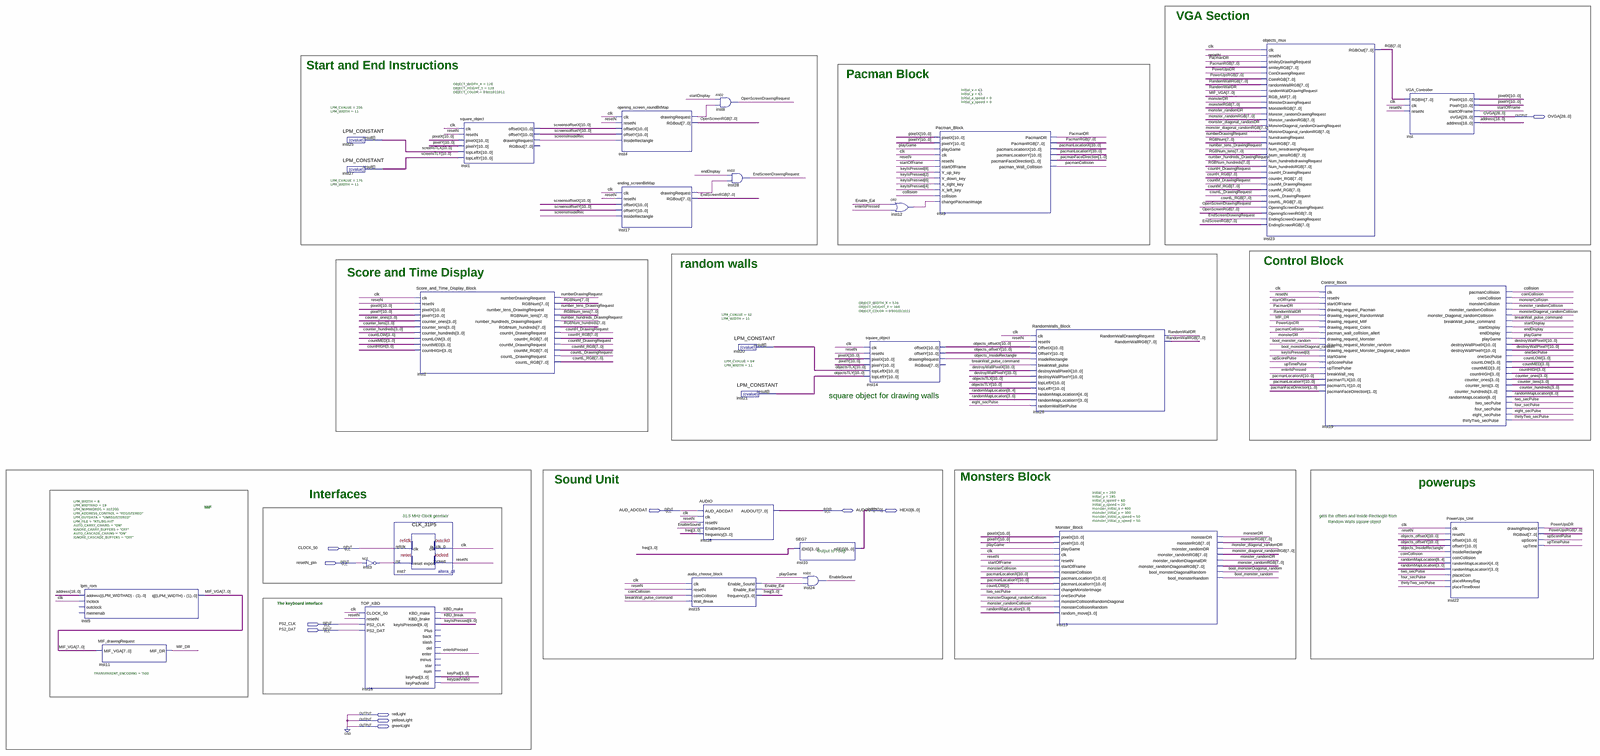
[diagram p0: schematic sheet, whole]
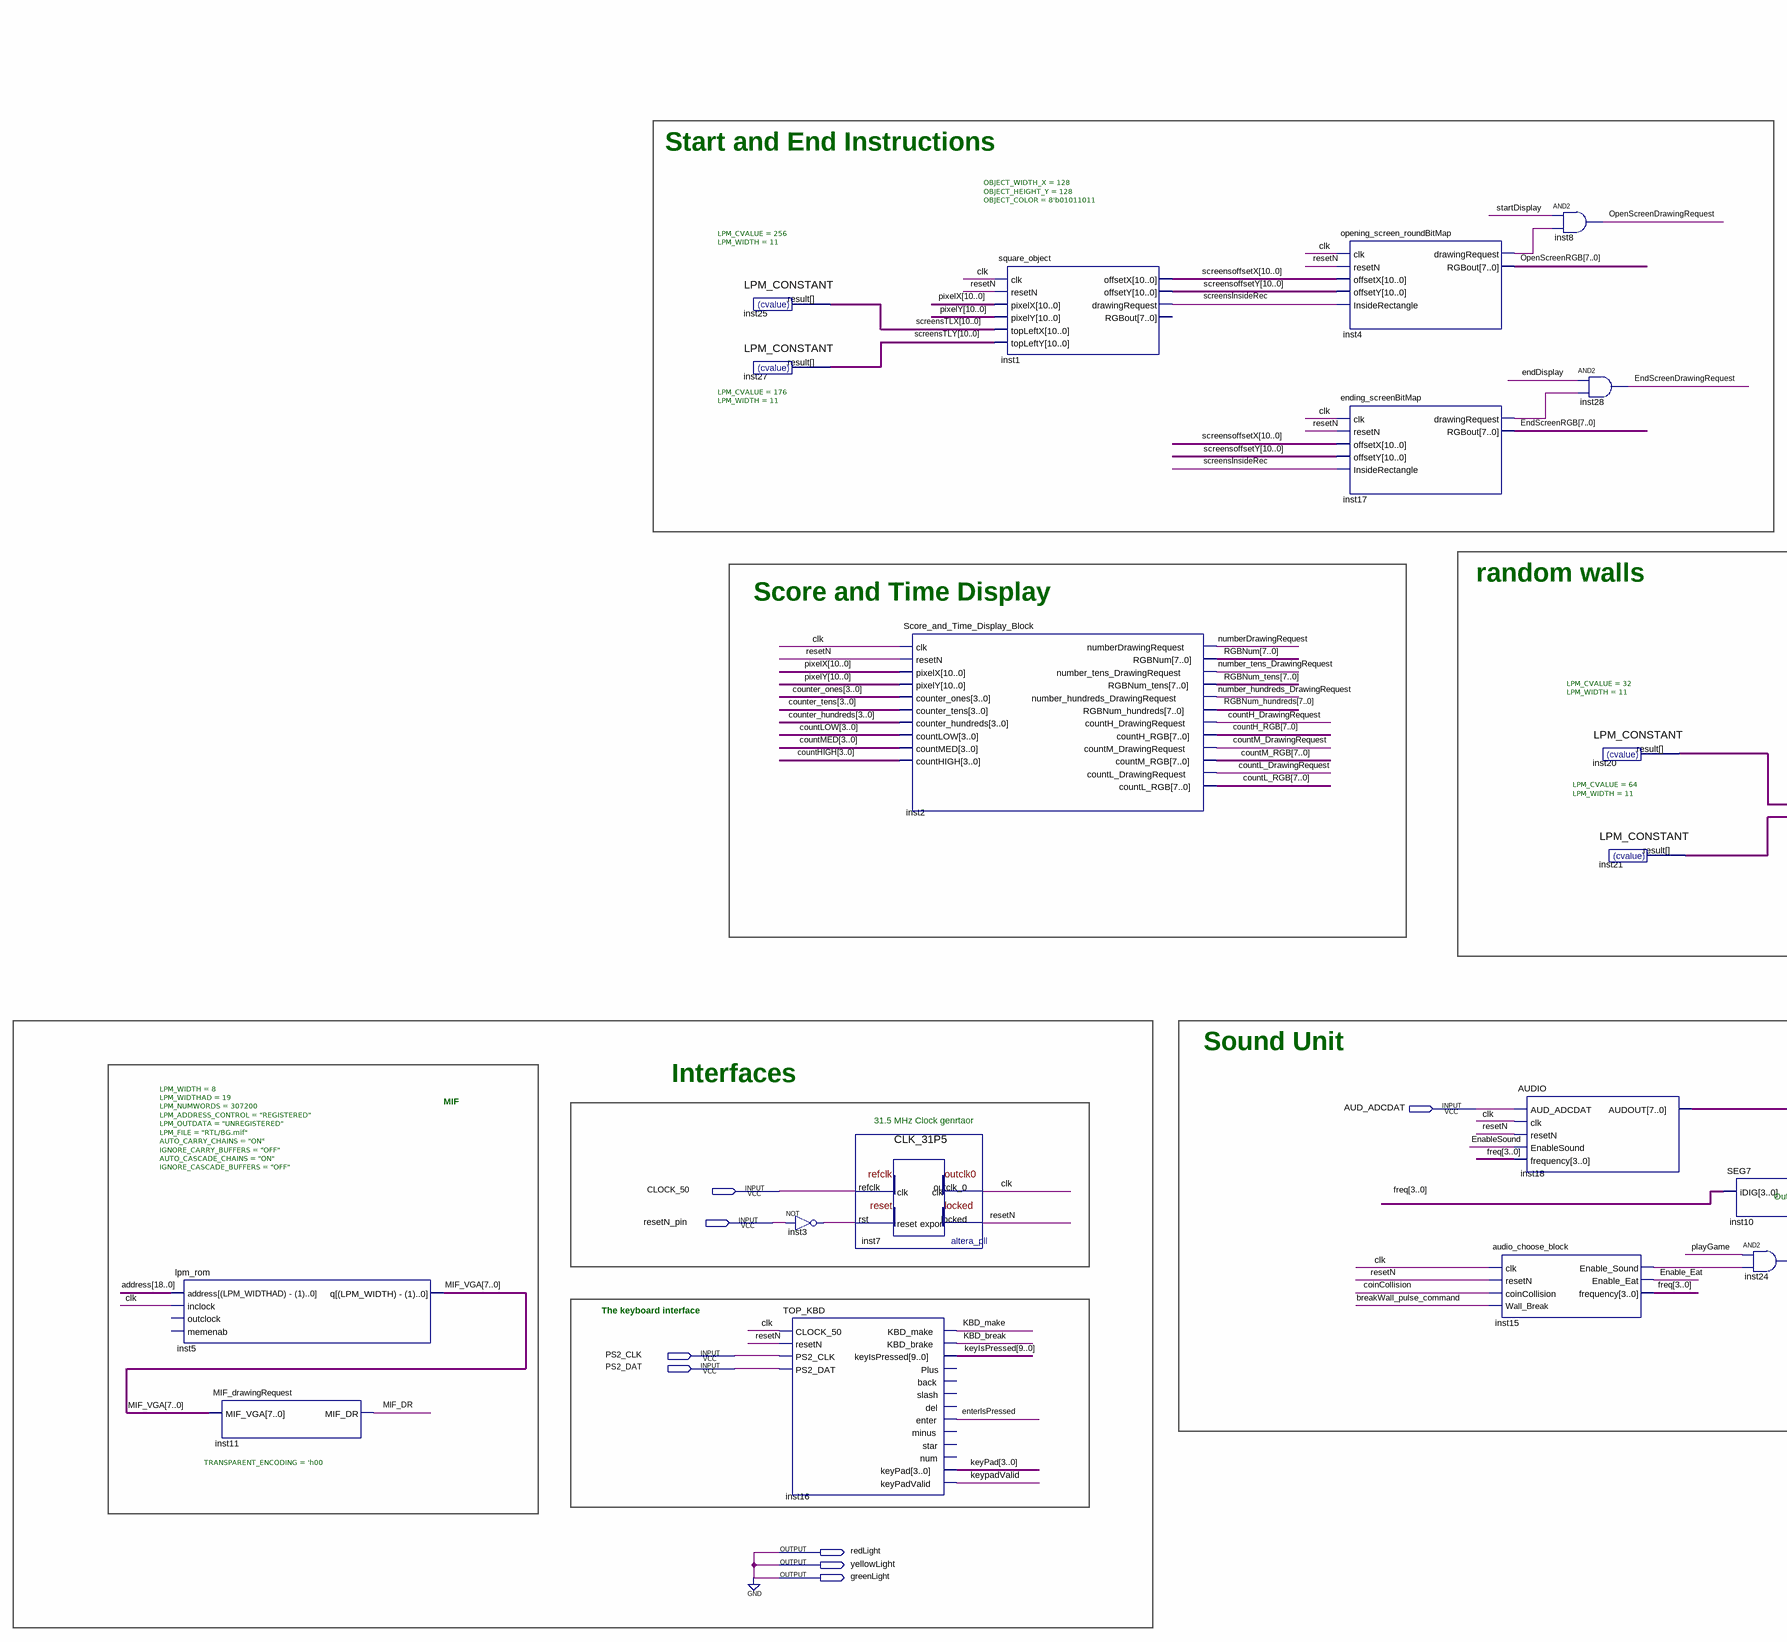
[diagram p1: schematic sheet, left part]
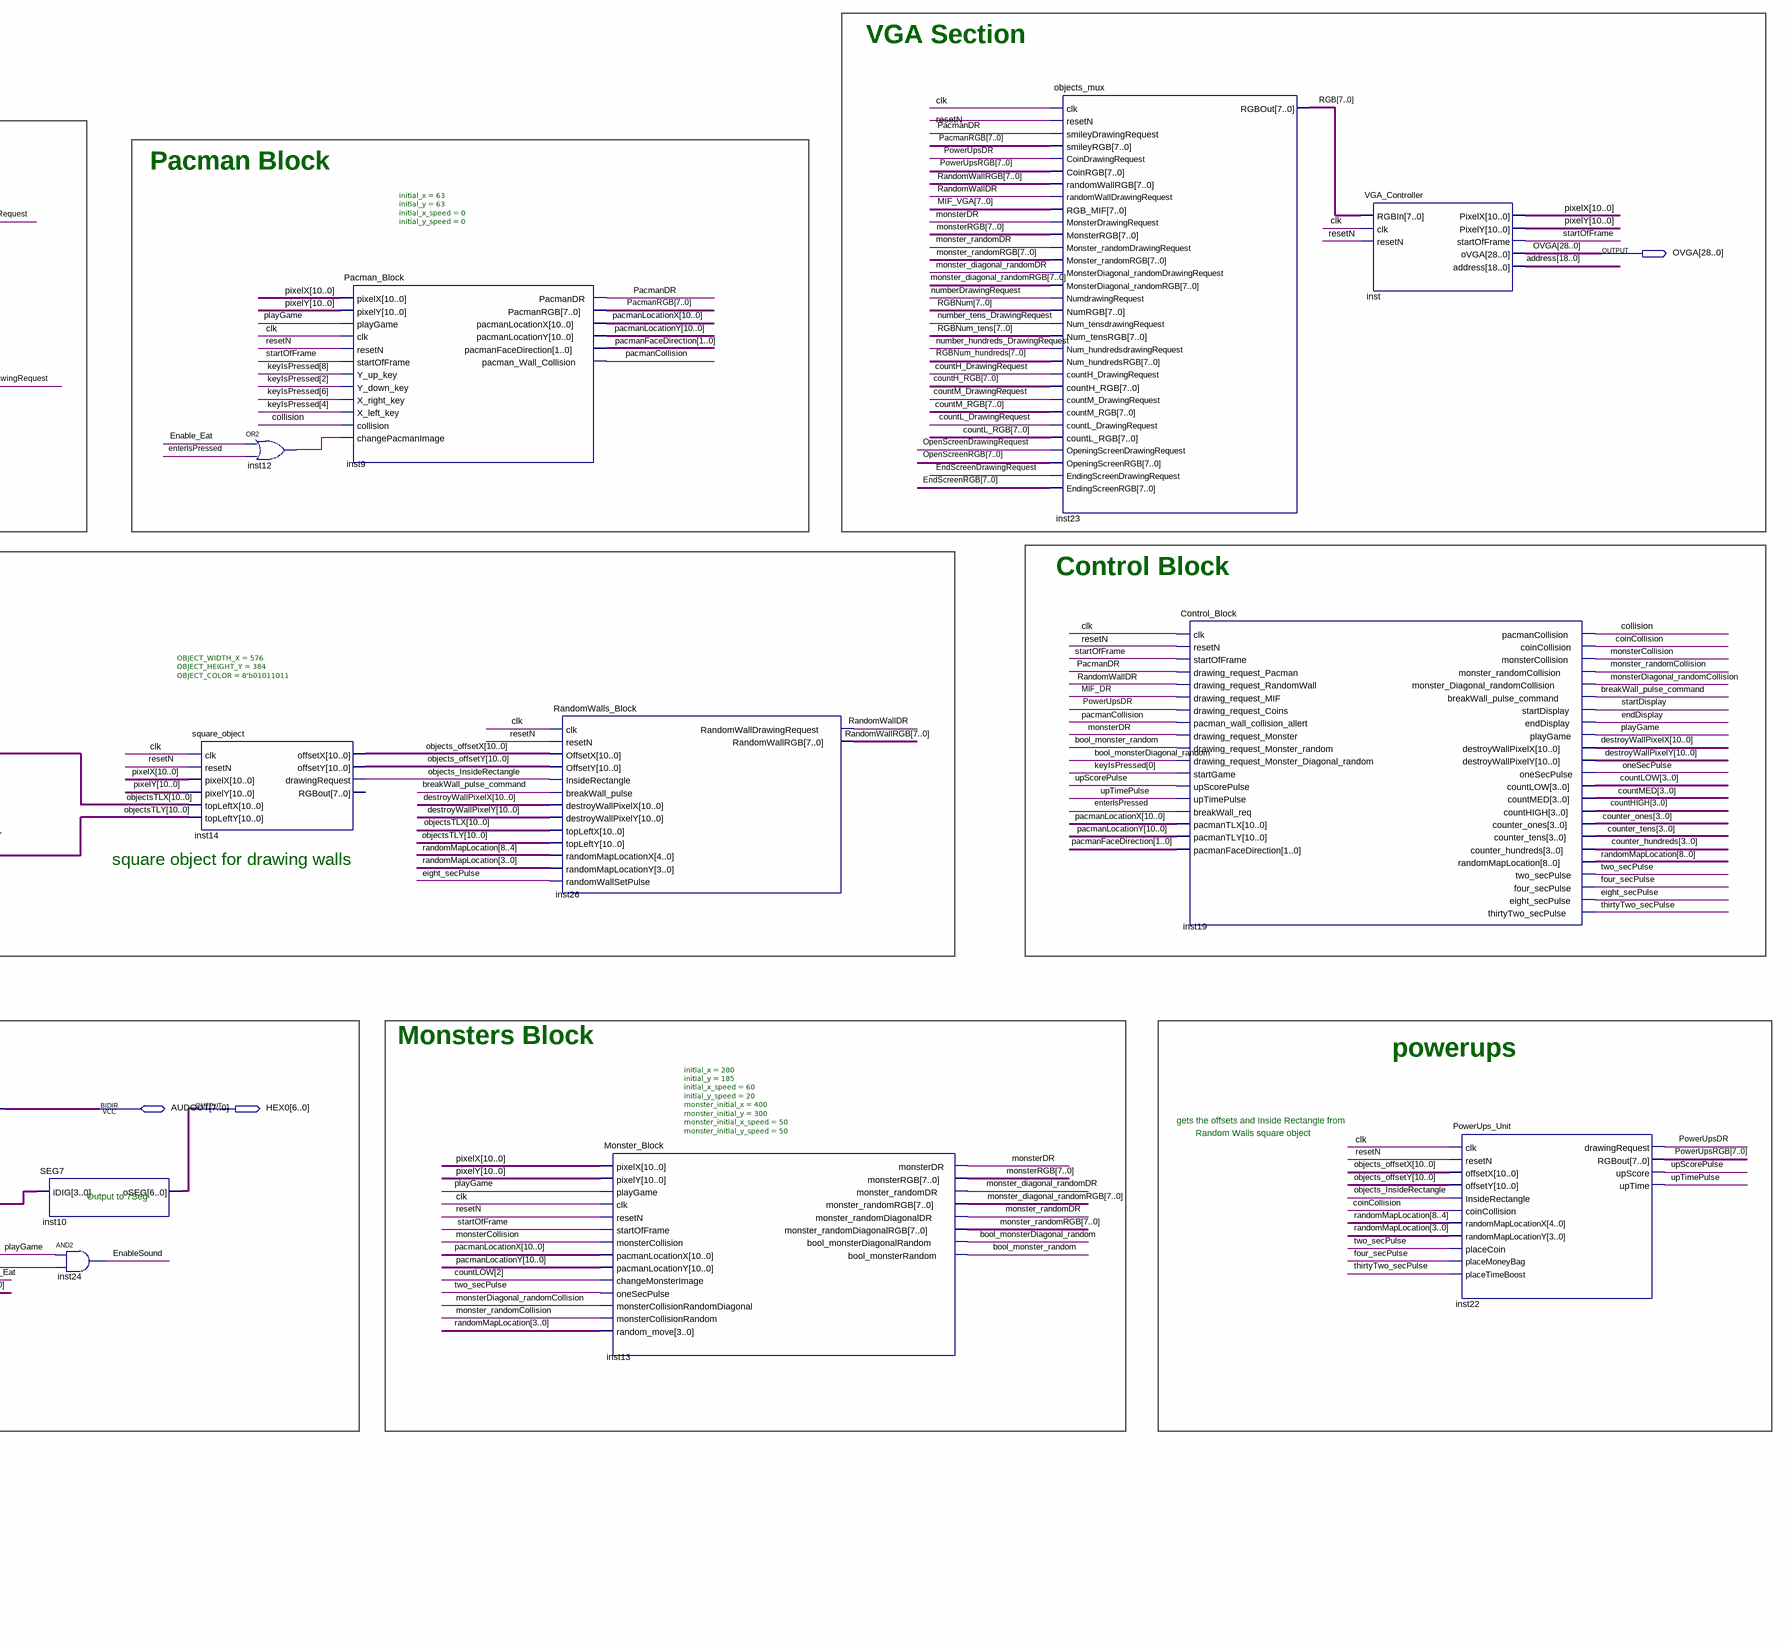
[diagram p2: schematic sheet, right part]
// Quartus schematic TOP_VGA_DEMO_KBD.bdf as structural Verilog: 28 symbols, 11 pins
module TOP_VGA_DEMO_KBD (
  input  AUD_ADCDAT,
  input  CLOCK_50,
  input  resetN_pin,
  input  PS2_CLK,
  input  PS2_DAT,
  inout  [7:0] AUDOUT,
  output [28:0] OVGA,
  output [6:0] HEX0,
  output redLight,
  output yellowLight,
  output greenLight
);

  wire bool_monster_random, bool_monsterDiagonal_random, breakWall_pulse_command, clk, coinCollision,
       collision, countH_DrawingRequest, countL_DrawingRequest, countM_DrawingRequest, eight_secPulse,
       Enable_Eat, EnableSound, endDisplay, EndScreenDrawingRequest, enterIsPressed, four_secPulse,
       inst3_out, inst4_drawingrequest, inst12_out, inst15_enable_sound, inst17_drawingrequest, KBD_break,
       KBD_make, keypadValid, MIF_DR, monster_diagonal_randomDR, monster_randomCollision, monster_randomDR,
       monsterCollision, monsterDiagonal_randomCollision, monsterDR, number_hundreds_DrawingRequest,
       number_tens_DrawingRequest, numberDrawingRequest, objects_InsideRectangle, oneSecPulse,
       OpenScreenDrawingRequest, pacmanCollision, PacmanDR, playGame, PowerUpsDR, RandomWallDR, resetN,
       screensInsideRec, startDisplay, startOfFrame, thirtyTwo_secPulse, two_secPulse, upScorePulse,
       upTimePulse;
  wire [1:0] pacmanFaceDirection;
  wire [3:0] counter_hundreds, counter_ones, counter_tens, countHIGH, countLOW, countMED, freq, keyPad;
  wire [7:0] countH_RGB, countL_RGB, countM_RGB, EndScreenRGB, MIF_VGA, monster_diagonal_randomRGB,
       monster_randomRGB, monsterRGB, OpenScreenRGB, PacmanRGB, PowerUpsRGB, RandomWallRGB, RGB, RGBNum,
       RGBNum_hundreds, RGBNum_tens;
  wire [8:0] randomMapLocation;
  wire [9:0] keyIsPressed;
  wire [10:0] destroyWallPixelX, destroyWallPixelY, objects_offsetX, objects_offsetY, objectsTLX, objectsTLY,
       pacmanLocationX, pacmanLocationY, pixelX, pixelY, screensoffsetX, screensoffsetY, screensTLX,
       screensTLY;
  wire [18:0] address;

  lpm_rom #(.LPM_WIDTH(8), .LPM_WIDTHAD(19), .LPM_NUMWORDS(307200), .LPM_ADDRESS_CONTROL("REGISTERED"), .LPM_OUTDATA("UNREGISTERED"), .LPM_FILE("RTL/BG.mif"), .AUTO_CARRY_CHAINS("ON"), .IGNORE_CARRY_BUFFERS("OFF"), .AUTO_CASCADE_CHAINS("ON"), .IGNORE_CASCADE_BUFFERS("OFF")) inst5 (
    .address(address), .inclock(clk), .q(MIF_VGA));  // open: outclock, memenab
  MIF_drawingRequest #(.TRANSPARENT_ENCODING('h00)) inst11 (.MIF_VGA(MIF_VGA), .MIF_DR(MIF_DR));
  LPM_CONSTANT #(.LPM_CVALUE(256), .LPM_WIDTH(11)) inst25 (.result(screensTLX));
  LPM_CONSTANT #(.LPM_CVALUE(176), .LPM_WIDTH(11)) inst27 (.result(screensTLY));
  not inst3 (inst3_out, resetN_pin);
  TOP_KBD inst16 (
    .CLOCK_50(clk), .resetN(resetN), .PS2_CLK(PS2_CLK), .PS2_DAT(PS2_DAT), .KBD_make(KBD_make),
    .KBD_brake(KBD_break), .keyIsPressed(keyIsPressed), .enter(enterIsPressed), .keyPad(keyPad),
    .keyPadValid(keypadValid));  // open: Plus, back, slash, del, minus, star, num
  CLK_31P5 inst7 (.refclk(CLOCK_50), .rst(inst3_out), .outclk_0(clk), .locked(resetN));
  Score_and_Time_Display_Block inst2 (
    .clk(clk), .resetN(resetN), .pixelX(pixelX), .pixelY(pixelY), .counter_ones(counter_ones),
    .counter_tens(counter_tens), .counter_hundreds(counter_hundreds), .countLOW(countLOW),
    .countMED(countMED), .countHIGH(countHIGH), .numberDrawingRequest(numberDrawingRequest), .RGBNum(RGBNum),
    .number_tens_DrawingRequest(number_tens_DrawingRequest), .RGBNum_tens(RGBNum_tens),
    .number_hundreds_DrawingRequest(number_hundreds_DrawingRequest), .RGBNum_hundreds(RGBNum_hundreds),
    .countH_DrawingRequest(countH_DrawingRequest), .countH_RGB(countH_RGB),
    .countM_DrawingRequest(countM_DrawingRequest), .countM_RGB(countM_RGB),
    .countL_DrawingRequest(countL_DrawingRequest), .countL_RGB(countL_RGB));
  square_object #(.OBJECT_WIDTH_X(128), .OBJECT_HEIGHT_Y(128), .OBJECT_COLOR(8'b01011011)) inst1 (
    .clk(clk), .resetN(resetN), .pixelX(pixelX), .pixelY(pixelY), .topLeftX(screensTLX),
    .topLeftY(screensTLY), .offsetX(screensoffsetX), .offsetY(screensoffsetY),
    .drawingRequest(screensInsideRec));  // open: RGBout
  opening_screen_roundBitMap inst4 (
    .clk(clk), .resetN(resetN), .offsetX(screensoffsetX), .offsetY(screensoffsetY),
    .InsideRectangle(screensInsideRec), .drawingRequest(inst4_drawingrequest), .RGBout(OpenScreenRGB));
  ending_screenBitMap inst17 (
    .clk(clk), .resetN(resetN), .offsetX(screensoffsetX), .offsetY(screensoffsetY),
    .InsideRectangle(screensInsideRec), .drawingRequest(inst17_drawingrequest), .RGBout(EndScreenRGB));
  audio_choose_block inst15 (
    .clk(clk), .resetN(resetN), .coinCollision(coinCollision), .Wall_Break(breakWall_pulse_command),
    .Enable_Sound(inst15_enable_sound), .Enable_Eat(Enable_Eat), .frequency(freq));
  and inst8 (OpenScreenDrawingRequest, startDisplay, inst4_drawingrequest);
  AUDIO inst18 (
    .AUD_ADCDAT(AUD_ADCDAT), .clk(clk), .resetN(resetN), .EnableSound(EnableSound), .frequency(freq),
    .AUDOUT(AUDOUT));
  and inst28 (EndScreenDrawingRequest, endDisplay, inst17_drawingrequest);
  LPM_CONSTANT #(.LPM_CVALUE(32), .LPM_WIDTH(11)) inst20 (.result(objectsTLX));
  LPM_CONSTANT #(.LPM_CVALUE(64), .LPM_WIDTH(11)) inst21 (.result(objectsTLY));
  SEG7 inst10 (.iDIG(freq), .oSEG(HEX0));
  and inst24 (EnableSound, playGame, inst15_enable_sound);
  square_object #(.OBJECT_WIDTH_X(576), .OBJECT_HEIGHT_Y(384), .OBJECT_COLOR(8'b01011011)) inst14 (
    .clk(clk), .resetN(resetN), .pixelX(pixelX), .pixelY(pixelY), .topLeftX(objectsTLX),
    .topLeftY(objectsTLY), .offsetX(objects_offsetX), .offsetY(objects_offsetY),
    .drawingRequest(objects_InsideRectangle));  // open: RGBout
  or inst12 (inst12_out, Enable_Eat, enterIsPressed);
  Pacman_Block #(.initial_x(63), .initial_y(63), .initial_x_speed(0), .initial_y_speed(0)) inst9 (
    .pixelX(pixelX), .pixelY(pixelY), .playGame(playGame), .clk(clk), .resetN(resetN),
    .startOfFrame(startOfFrame), .Y_up_key(keyIsPressed[8]), .Y_down_key(keyIsPressed[2]),
    .X_right_key(keyIsPressed[6]), .X_left_key(keyIsPressed[4]), .collision(collision),
    .changePacmanImage(inst12_out), .PacmanDR(PacmanDR), .PacmanRGB(PacmanRGB),
    .pacmanLocationX(pacmanLocationX), .pacmanLocationY(pacmanLocationY),
    .pacmanFaceDirection(pacmanFaceDirection), .pacman_Wall_Collision(pacmanCollision));
  RandomWalls_Block inst26 (
    .clk(clk), .resetN(resetN), .OffsetX(objects_offsetX), .OffsetY(objects_offsetY),
    .InsideRectangle(objects_InsideRectangle), .breakWall_pulse(breakWall_pulse_command),
    .destroyWallPixelX(destroyWallPixelX), .destroyWallPixelY(destroyWallPixelY), .topLeftX(objectsTLX),
    .topLeftY(objectsTLY), .randomMapLocationX(randomMapLocation[8:4]),
    .randomMapLocationY(randomMapLocation[3:0]), .randomWallSetPulse(eight_secPulse),
    .RandomWallDrawingRequest(RandomWallDR), .RandomWallRGB(RandomWallRGB));
  Monster_Block #(.initial_x(280), .initial_y(185), .initial_x_speed(60), .initial_y_speed(20), .monster_initial_x(400), .monster_initial_y(300), .monster_initial_x_speed(50), .monster_initial_y_speed(50)) inst13 (
    .pixelX(pixelX), .pixelY(pixelY), .playGame(playGame), .clk(clk), .resetN(resetN),
    .startOfFrame(startOfFrame), .monsterCollision(monsterCollision), .pacmanLocationX(pacmanLocationX),
    .pacmanLocationY(pacmanLocationY), .changeMonsterImage(countLOW[2]), .oneSecPulse(two_secPulse),
    .monsterCollisionRandomDiagonal(monsterDiagonal_randomCollision),
    .monsterCollisionRandom(monster_randomCollision), .random_move(randomMapLocation[3:0]),
    .monsterDR(monsterDR), .monsterRGB(monsterRGB), .monster_randomDR(monster_diagonal_randomDR),
    .monster_randomRGB(monster_diagonal_randomRGB), .monster_randomDiagonalDR(monster_randomDR),
    .monster_randomDiagonalRGB(monster_randomRGB), .bool_monsterDiagonalRandom(bool_monsterDiagonal_random),
    .bool_monsterRandom(bool_monster_random));
  objects_mux inst23 (
    .clk(clk), .resetN(resetN), .smileyDrawingRequest(PacmanDR), .smileyRGB(PacmanRGB),
    .CoinDrawingRequest(PowerUpsDR), .CoinRGB(PowerUpsRGB), .randomWallRGB(RandomWallRGB),
    .randomWallDrawingRequest(RandomWallDR), .RGB_MIF(MIF_VGA), .MonsterDrawingRequest(monsterDR),
    .MonsterRGB(monsterRGB), .Monster_randomDrawingRequest(monster_randomDR),
    .Monster_randomRGB(monster_randomRGB), .MonsterDiagonal_randomDrawingRequest(monster_diagonal_randomDR),
    .MonsterDiagonal_randomRGB(monster_diagonal_randomRGB), .NumdrawingRequest(numberDrawingRequest),
    .NumRGB(RGBNum), .Num_tensdrawingRequest(number_tens_DrawingRequest), .Num_tensRGB(RGBNum_tens),
    .Num_hundredsdrawingRequest(number_hundreds_DrawingRequest), .Num_hundredsRGB(RGBNum_hundreds),
    .countH_DrawingRequest(countH_DrawingRequest), .countH_RGB(countH_RGB),
    .countM_DrawingRequest(countM_DrawingRequest), .countM_RGB(countM_RGB),
    .countL_DrawingRequest(countL_DrawingRequest), .countL_RGB(countL_RGB),
    .OpeningScreenDrawingRequest(OpenScreenDrawingRequest), .OpeningScreenRGB(OpenScreenRGB),
    .EndingScreenDrawingRequest(EndScreenDrawingRequest), .EndingScreenRGB(EndScreenRGB), .RGBOut(RGB));
  Control_Block inst19 (
    .clk(clk), .resetN(resetN), .startOfFrame(startOfFrame), .drawing_request_Pacman(PacmanDR),
    .drawing_request_RandomWall(RandomWallDR), .drawing_request_MIF(MIF_DR),
    .drawing_request_Coins(PowerUpsDR), .pacman_wall_collision_allert(pacmanCollision),
    .drawing_request_Monster(monsterDR), .drawing_request_Monster_random(bool_monster_random),
    .drawing_request_Monster_Diagonal_random(bool_monsterDiagonal_random), .startGame(keyIsPressed[0]),
    .upScorePulse(upScorePulse), .upTimePulse(upTimePulse), .breakWall_req(enterIsPressed),
    .pacmanTLX(pacmanLocationX), .pacmanTLY(pacmanLocationY), .pacmanFaceDirection(pacmanFaceDirection),
    .pacmanCollision(collision), .coinCollision(coinCollision), .monsterCollision(monsterCollision),
    .monster_randomCollision(monster_randomCollision),
    .monster_Diagonal_randomCollision(monsterDiagonal_randomCollision),
    .breakWall_pulse_command(breakWall_pulse_command), .startDisplay(startDisplay), .endDisplay(endDisplay),
    .playGame(playGame), .destroyWallPixelX(destroyWallPixelX), .destroyWallPixelY(destroyWallPixelY),
    .oneSecPulse(oneSecPulse), .countLOW(countLOW), .countMED(countMED), .countHIGH(countHIGH),
    .counter_ones(counter_ones), .counter_tens(counter_tens), .counter_hundreds(counter_hundreds),
    .randomMapLocation(randomMapLocation), .two_secPulse(two_secPulse), .four_secPulse(four_secPulse),
    .eight_secPulse(eight_secPulse), .thirtyTwo_secPulse(thirtyTwo_secPulse));
  VGA_Controller inst (
    .RGBIn(RGB), .clk(clk), .resetN(resetN), .PixelX(pixelX), .PixelY(pixelY), .startOfFrame(startOfFrame),
    .oVGA(OVGA), .address(address));
  PowerUps_Unit inst22 (
    .clk(clk), .resetN(resetN), .offsetX(objects_offsetX), .offsetY(objects_offsetY),
    .InsideRectangle(objects_InsideRectangle), .coinCollision(coinCollision),
    .randomMapLocationX(randomMapLocation[8:4]), .randomMapLocationY(randomMapLocation[3:0]),
    .placeCoin(two_secPulse), .placeMoneyBag(four_secPulse), .placeTimeBoost(thirtyTwo_secPulse),
    .drawingRequest(PowerUpsDR), .RGBout(PowerUpsRGB), .upScore(upScorePulse), .upTime(upTimePulse));

  assign greenLight = 1'b0;
  assign redLight = 1'b0;
  assign yellowLight = 1'b0;

  // Notes on the sheet:
  //   VGA Section
  //   Start and End Instructions      
  //   Pacman Block 
  //   Control Block
  //   random walls     
  //   Score and Time Display      
  //   square object for drawing walls
  //   Monsters Block    
  //   Sound Unit    
  //   powerups      
  //   Interfaces    
  //   MIF
  //   31.5 MHz Clock genrtaor
  //   gets the offsets and Inside Rectangle from 
  //   Random Walls square object
  //   Output to 7Seg
  //   The keyboard interface
endmodule
